# EAGLE design pins (EAGLE 7.4.0)
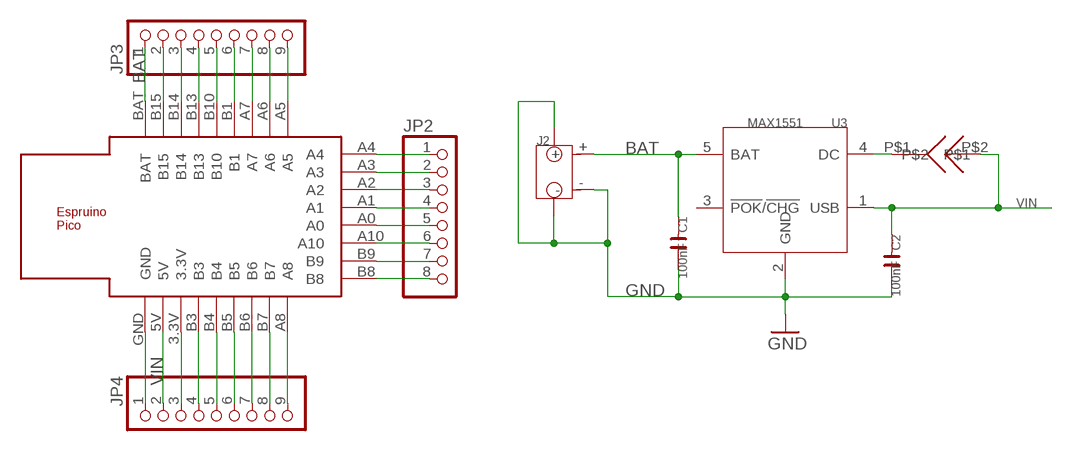
[diagram p0: schematic, sheet 1]

## Parts
C1  100nF  C-0603  [C0603]
C2  100nF  C-0603  [C0603]
J2  JST-2P-SMD-PW-3410050P1  [2P-SMD-2.0-90D]
JP2  PINHD-1X08_2.54-S  [1X08-S]
JP3  PINHD-1X09_2.54-S  [1X09-S]
JP4  PINHD-1X09_2.54-S  [1X09-S]
U3  MAX1551  [SOT23-5]
U$1  ESPRUINO_PICO_SMD  [ESPRUINO_PICO_SMD]
U$4  SOLDERJUMPER  [SOLDERJUMPER]

## Nets
BAT: C1.1 J2.+ JP3.1 U3.5(BAT) U$1.BAT
GND: C1.2 C2.2 J2.3 J2.4 J2.- JP4.1 U3.2(GND) U$1.GND
N$1: JP2.2 U$1.A3
N$2: JP2.3 U$1.A2
N$3: JP2.4 U$1.A1
N$4: JP2.5 U$1.A0
N$5: JP2.6 U$1.A10
N$6: JP2.7 U$1.B9
N$7: JP4.3 U$1.3.3V
N$8: JP4.4 U$1.B3
N$9: JP2.8 U$1.B8
N$10: JP4.5 U$1.B4
N$11: JP4.6 U$1.B5
N$12: JP4.7 U$1.B6
N$13: JP4.8 U$1.B7
N$14: JP4.9 U$1.A8
N$15: U3.4(DC) U$4.P$1
N$16: JP3.2 U$1.B15
N$17: JP3.3 U$1.B14
N$18: JP3.4 U$1.B13
N$19: JP3.5 U$1.B10
N$20: JP3.6 U$1.B1
N$21: JP3.7 U$1.A7
N$22: JP3.8 U$1.A6
N$23: JP3.9 U$1.A5
N$24: JP2.1 U$1.A4
VIN [power]: C2.1 JP4.2 U3.1(USB) U$1.5V U$4.P$2
Unconnected: U3.3(!POK!/!CHG!)

## Library data of the parts
C1 C2 = OPL5:C*
J2 = OPL Eagle Library:JST-2P-SMD-PW
JP2 = pinhead-2:PINHD-1X08: PIN HEADER
JP3 JP4 = pinhead-2:PINHD-1X09: PIN HEADER
U3 = template:MAX1551: SOT23 Dual-Input USB/AC Adapter 1-Cell Li+ Battery Chargers
U$1 = espruino_pico:ESPRUINO_PICO_SMD
U$4 = solder_jumper:SOLDERJUMPER

## Net classes
0 default: width 0.305 mm
1 power: width 0.406 mm

## Board
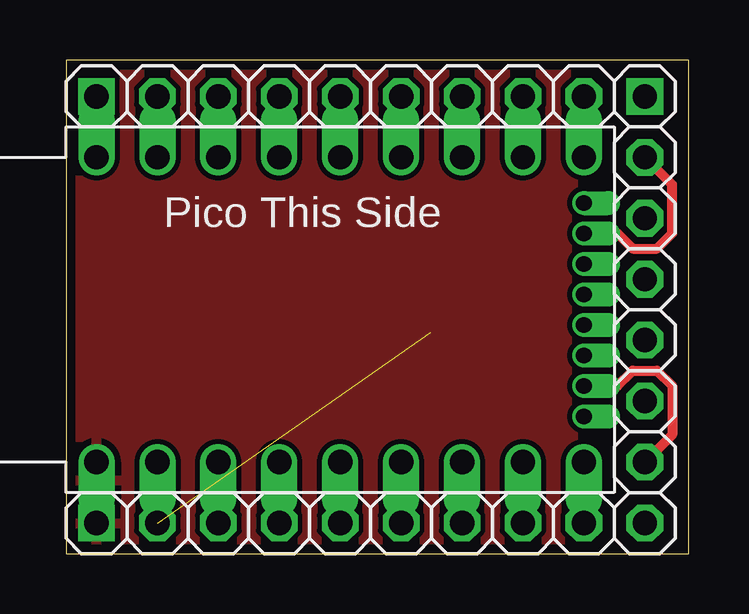
[diagram p1: board, top side]
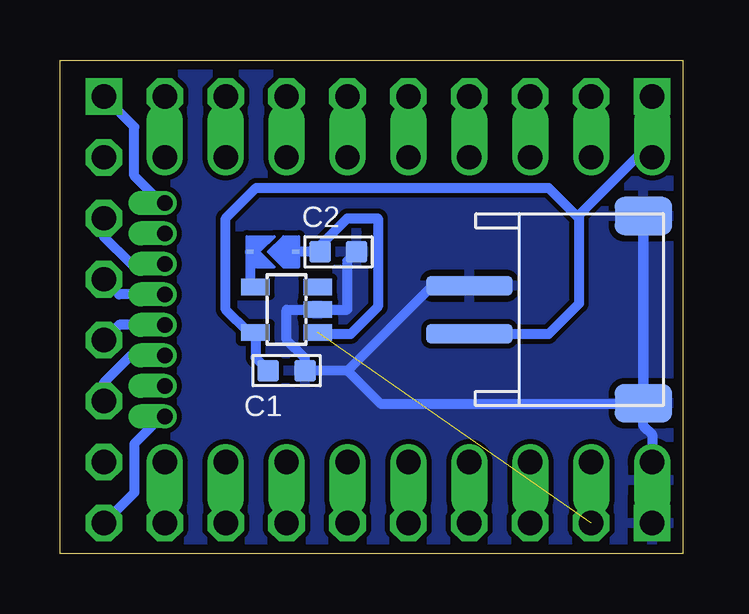
[diagram p2: board, bottom side, seen from below]

Size 25.96 x 20.56 mm. Coordinates in mm from the lower left corner, seen from the top.
Outline: 0,0 25.96,0 25.96,20.56 0,20.56 0,0
Copper layers (1*16): Top 0.0356mm / dielectric 1.5011mm / Bottom 0.0356mm
Design rules "oshpark": minimum track width 10mil, minimum drill 13mil, track to track 8mil, track to pad 6mil, pad to pad 6mil, via to via 6mil, smd to smd 6mil, copper to edge 15mil, drill to drill 6mil, minimum pad ring 7mil, minimum via ring 7mil, stop-mask expansion 4mil, vias tented up to drill 15mil, thermal gap 10mil

### Footprints (pad centres in the part's own frame; a part is rotated, then mirrored left to right if it is on the bottom)
C0603 = smd 0.889 x 0.889: 1 -0.762,0; 2 0.762,0
2P-SMD-2.0-90D = smd 1.6 x 2.4: 3 3.9,-2.181; 4 -3.9,-2.181 | smd 0.8 x 3.6: + -1,5.08; - 1,5.08
1X08-S = drill 1.016 square: 1 -8.89,0 | drill 1.016 octagon: 2 -6.35,0; 3 -3.81,0; 4 -1.27,0; 5 1.27,0; 6 3.81,0; 7 6.35,0; 8 8.89,0
1X09-S = drill 1.016 square: 1 -10.16,0 | drill 1.016 octagon: 2 -7.62,0; 3 -5.08,0; 4 -2.54,0; 5 0,0; 6 2.54,0; 7 5.08,0; 8 7.62,0; 9 10.16,0
SOT23-5 = smd 0.69 x 1.2: 1 -0.95,-1.3; 2 0,-1.3; 3 0.95,-1.3; 4 0.95,1.3; 5 -0.95,1.3
ESPRUINO_PICO_SMD = drill 1.016 offset: 3.3V -8.89,-6.35; 5V -11.43,-6.35; A5 6.35,6.35; A6 3.81,6.35; A7 1.27,6.35; A8 6.35,-6.35; B1 -1.27,6.35; B3 -6.35,-6.35; B4 -3.81,-6.35; B5 -1.27,-6.35; B6 1.27,-6.35; B7 3.81,-6.35; B10 -3.81,6.35; B13 -6.35,6.35; B14 -8.89,6.35; B15 -11.43,6.35; BAT -13.97,6.35; GND -13.97,-6.35 | drill 0.65 pad 0.965 offset: A0 6.35,-0.635; A1 6.35,0.635; A2 6.35,1.905; A3 6.35,3.175; A4 6.35,4.445; A10 6.35,-1.905; B8 6.35,-4.445; B9 6.35,-3.175
SOLDERJUMPER = smd 0.305 x 0.152: P$1 0.762,0; P$2 -1.143,0

### Placement (x,y rotation side)
C1  16.51,7.62 0 bottom
C2  14.35,12.57 0 bottom
J2  3.81,10.16 90 bottom
JP2  24.13,10.16 270 top
JP3  11.43,19.05 0 top
JP4  11.43,1.27 0 top
U3  16.51,10.16 90 bottom
U$1  15.24,10.16 0 top
U$4  17.27,12.57 180 bottom

### Tracks (layer width: path | path; a pad name or v marks a point on that pad's centre or on a via)
BAT
  Bottom 0.406: U$1.BAT 1.91,16.51 4.32,14.1 4.32,13.97 | 4.32,13.97 4.32,10.41 5.59,9.14 8.87,9.14 J2.+ | C1.1 17.81,8.16 U3.5 18.1,9.21 19.05,10.16 19.05,13.97 17.78,15.24 5.59,15.24 4.32,13.97
  Bottom 1.016: U$1.BAT JP3.1
GND
  Bottom 0.406: U$1.GND 1.27,4.95 1.63,5.31 J2.4 J2.3 1.63,6.37 1.78,6.22 12.57,6.22 13.97,7.62 | C2.2 13.97,12.19 13.97,10.16 U3.2 16.51,10.16 16.51,8.89 15.75,8.13 C1.2 13.97,7.62 | J2.- 10.43,11.16 13.97,7.62
  Bottom 1.016: U$1.GND JP4.1
  pour Top: 0,20.32 25.91,20.32 25.91,-0.25 0,-0.25
  pour Bottom: 0,20.32 27.18,20.32 27.18,0 0,0
N$1
  Top 0.406: U$1.A3 22.99,13.34 23.62,12.7 24.64,12.7 25.27,13.34 25.27,15.37 JP2.2
N$2
  Bottom 0.406: U$1.A2 22.99,12.06 24.13,13.21 JP2.3
N$3
  Bottom 0.406: U$1.A1 23.5,10.79 JP2.4
N$4
  Bottom 0.406: U$1.A0 23.5,9.53 JP2.5
N$5
  Bottom 0.406: U$1.A10 22.99,8.26 24.13,7.11 JP2.6
N$6
  Top 0.406: U$1.B9 22.99,6.99 23.62,7.62 24.64,7.62 25.27,6.99 25.27,4.95 JP2.7
N$7
  Bottom 1.016: U$1.3.3V JP4.3
N$8
  Bottom 1.016: U$1.B3 JP4.4
N$9
  Bottom 0.406: U$1.B8 21.72,5.71 22.86,4.57 22.86,2.54 JP2.8
N$10
  Bottom 1.016: U$1.B4 JP4.5
N$11
  Bottom 1.016: U$1.B5 JP4.6
N$12
  Bottom 1.016: U$1.B6 JP4.7
N$13
  Bottom 1.016: U$1.B7 JP4.8
N$14
  Bottom 1.016: U$1.A8 JP4.9
N$15
  Bottom 0.406: U$4.P$1 18.03,11.33 U3.4
N$16
  Bottom 1.016: U$1.B15 JP3.2
N$17
  Bottom 1.016: U$1.B14 JP3.3
N$18
  Bottom 1.016: U$1.B13 JP3.4
N$19
  Bottom 1.016: U$1.B10 JP3.5
N$20
  Bottom 1.016: U$1.B1 JP3.6
N$21
  Bottom 1.016: U$1.A7 JP3.7
N$22
  Bottom 1.016: U$1.A6 JP3.8
N$23
  Bottom 1.016: U$1.A5 JP3.9
N$24
  Bottom 0.406: U$1.A4 21.72,14.61 22.86,15.75 22.86,17.78 JP2.1
VIN  (1 unrouted)
  Bottom 0.406: U$4.P$2 C2.1 15.11,12.83 13.97,13.97 12.7,13.97 12.7,10.29 13.84,9.14 15.14,9.14 U3.1
  Bottom 1.016: U$1.5V JP4.2

### Text on the board
tNames: Pico This Side